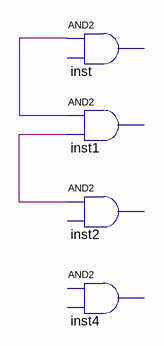
[diagram p0: schematic sheet]
// Quartus schematic test.bdf as structural Verilog: 4 symbols, 0 pins
module test (
);

  wire undriven, undriven_2;

  // AND2 inst has open pins: IN1=undriven, IN2=open, OUT=open
  // AND2 inst1 has open pins: IN1=undriven, IN2=undriven_2, OUT=open
  // AND2 inst2 has open pins: IN1=undriven_2, IN2=open, OUT=open
  // AND2 inst4 is placed but not wired
endmodule
